# Altium schematic sheet USB.SchDoc
size A
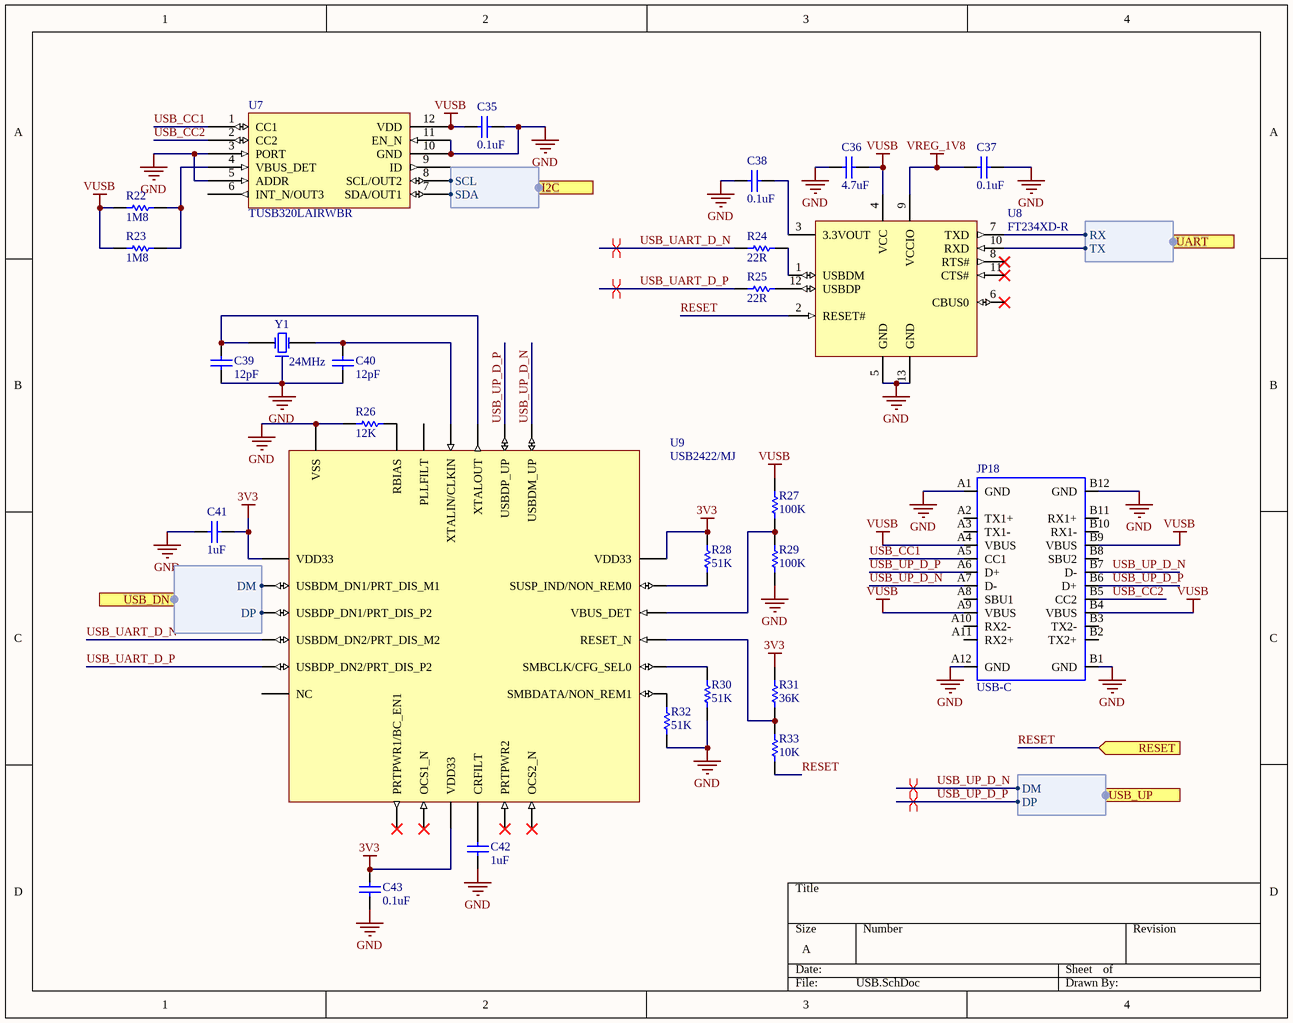
[diagram p0: USB.SchDoc]

## Parts
C35  value 0.1uF  [C0402[1005X55]]  (hidden comment: 0.1uF 6.3V 0402)
C36  value 4.7uF  [C0402[1005X55]]  (hidden comment: 4.7uF 6.3V 0402)
C37  value 0.1uF  [C0402[1005X55]]  (hidden comment: 0.1uF 6.3V 0402)
C38  value 0.1uF  [C0402[1005X55]]  (hidden comment: 0.1uF 6.3V 0402)
C39  value 12pF  [C0402[1005X55]]  (hidden comment: 12pF 50V 0402)
C40  value 12pF  [C0402[1005X55]]  (hidden comment: 12pF 50V 0402)
C41  value 1uF  [C0402[1005X55]]  (hidden comment: 1uF 6.3V 0402)
C42  value 1uF  [C0402[1005X55]]  (hidden comment: 1uF 6.3V 0402)
C43  value 0.1uF  [C0402[1005X55]]  (hidden comment: 0.1uF 6.3V 0402)
JP18  USB-C  [USB-C-3.1]
R22  value 1M8  [R0402[1005]]  (hidden comment: 1M8 1% 0402)
R23  value 1M8  [R0402[1005]]  (hidden comment: 1M8 1% 0402)
R24  value 22R  [R0402[1005]]  (hidden comment: 22R 1% 0402)
R25  value 22R  [R0402[1005]]  (hidden comment: 22R 1% 0402)
R26  value 12K  [R0402[1005]]  (hidden comment: 12K 1% 0402)
R27  value 100K  [R0402[1005]]  (hidden comment: 100K 1% 0402)
R28  value 51K  [R0402[1005]]  (hidden comment: 51K 1% 0402)
R29  value 100K  [R0402[1005]]  (hidden comment: 100K 1% 0402)
R30  value 51K  [R0402[1005]]  (hidden comment: 51K 1% 0402)
R31  value 36K  [R0402[1005]]  (hidden comment: 36K 1% 0402)
R32  value 51K  [R0402[1005]]  (hidden comment: 51K 1% 0402)
R33  value 10K  [R0402[1005]]  (hidden comment: 10K 1% 0402)
U7  TUSB320LAIRWBR  [X2QFN-12]
U8  FT234XD-R  [DFN-12]
U9  USB2422/MJ  [QFN-24 (4x4MM)]
Y1  24MHz  [CRYSTAL_2.0x1.6]

## Ports
I2C (harness I2C), RESET (in), UART (harness UART), USB_DN (harness USB), USB_UP (harness USB)

## Harnesses
USB: DM, DP
UART: TX, RX
I2C: SCL, SDA

## Nets
3V3: C41.2 C43.2 R28.2 R31.2 U9.1(VDD33) U9.9(VDD33) U9.18(VDD33)
GND: C35.1 C36.2 C37.1 C38.2 C39.1 C40.1 C41.1 C42.1 C43.1 JP18.A1(GND) JP18.A12(GND) JP18.B1(GND) JP18.B12(GND) R26.1 R29.1 R30.1 R32.1 U7.3(PORT) U7.5(ADDR) U7.10(GND) U7.11(EN_N) U8.5(GND) U8.13(GND) U9.25(VSS) Y1.2
VREG_1V8: C37.2 U8.9(VCCIO)
VUSB: C35.2 C36.1 JP18.A4(VBUS) JP18.A9(VBUS) JP18.B4(VBUS) JP18.B9(VBUS) R22.1 R23.1 R27.2 U7.12(VDD) U8.4(VCC)
RESET: R33.1 U8.2(RESET#) ; port RESET
USB_CC1: JP18.A5(CC1) U7.1(CC1)
USB_CC2: JP18.B5(CC2) U7.2(CC2)
USB_UART_D_N: R24.1 U9.4(USBDM_DN2/PRT_DIS_M2)
USB_UART_D_P: R25.1 U9.5(USBDP_DN2/PRT_DIS_P2)
USB_UP_D_N: JP18.A7(D-) JP18.B7(D-) U9.19(USBDM_UP) ; port USB_UP.DM
USB_UP_D_P: JP18.A6(D+) JP18.B6(D+) U9.20(USBDP_UP) ; port USB_UP.DP
NetC38_1: C38.1 U8.3(3.3VOUT)
NetC39_2: C39.2 U9.21(XTALOUT) Y1.1(X1)
NetC40_2: C40.2 U9.22(XTALIN/CLKIN) Y1.3(X2)
NetC42_2: C42.2 U9.10(CRFILT)
NetR22_2: R22.2 R23.2 U7.4(VBUS_DET)
NetR24_2: R24.2 U8.1(USBDM)
NetR25_2: R25.2 U8.12(USBDP)
NetR26_2: R26.2 U9.24(RBIAS)
NetR27_1: R27.1 R29.2 U9.16(VBUS_DET)
NetR28_1: R28.1 U9.17(SUSP_IND/NON_REM0)
NetR30_2: R30.2 U9.14(SMBCLK/CFG_SEL0)
NetR31_1: R31.1 R33.2 U9.15(RESET_N)
NetR32_2: R32.2 U9.13(SMBDATA/NON_REM1)
NetU7_7: U7.7(SDA/OUT1) ; port I2C.SDA
NetU7_8: U7.8(SCL/OUT2) ; port I2C.SCL
NetU8_7: U8.7(TXD) ; port UART.RX
NetU8_10: U8.10(RXD) ; port UART.TX
NetU9_2: U9.2(USBDM_DN1/PRT_DIS_M1) ; port USB_DN.DM
NetU9_3: U9.3(USBDP_DN1/PRT_DIS_P2) ; port USB_DN.DP

Not connected (* = marked no-connect by the designer): JP18 A2(TX1+) A3(TX1-) A8(SBU1) A10(RX2-) A11(RX2+) B2(TX2+) B3(TX2-) B8(SBU2) B10(RX1-) B11(RX1+); U7 6(INT_N/OUT3) 9(ID); U8 6(CBUS0)* 8(RTS#)* 11(CTS#)*; U9 6(NC) 7(PRTPWR1/BC_EN1)* 8(OCS1_N)* 11(PRTPWR2)* 12(OCS2_N)* 23(PLLFILT)

## Layout directives
differential pair: USB_UART_D_N, USB_UART_D_P, USB_UP_D_N, USB_UP_D_P

## Library data of the parts
C35 C37 C38 C43 = CAP_0.1uF_6.3V_0402_10%: 0.1uF 6.3V 10% 0402 (1005 Metric); PartNumber: GRM155R70J104KA01D; Manufacturer: Murata; Mounting Technology: Surface Mount; PackageReference: 0402; PackageDescription: 0402 (1005 Metric); Voltage: 6.3V; Tolerance: 10%
C36 = CAP_4.7uF_6.3V_0402_20%: 4.7uF 6.3V 20% 0402 (1005 Metric); PartNumber: GRM155R60J475ME47D; Manufacturer: Murata; Mounting Technology: Surface Mount; PackageReference: 0402; PackageDescription: 0402 (1005 Metric); Voltage: 6.3V; Tolerance: 20%
C39 C40 = CAP_12pF_50V_0402_5%: 12pF 50V 5% 0402 (1005 Metric); PartNumber: GRM1555C1H120JA01D; Manufacturer: Murata; Mounting Technology: Surface Mount; PackageReference: 0402; PackageDescription: 0402 (1005 Metric); Voltage: 50V; Tolerance: 5%
C41 C42 = CAP_1uF_6.3V_0402_10%: 1uF 6.3V 10% 0402 (1005 Metric); PartNumber: GRM155R70J105KA12D; Manufacturer: Murata; Mounting Technology: Surface Mount; PackageReference: 0402; PackageDescription: 0402 (1005 Metric); Voltage: 6.3V; Tolerance: 10%
JP18 = USB_C_3.1_SMT: PartNumber: 12401610E4#2A; Manufacturer: Amphenol FCI; Mounting Technology: Surface Mount; PackageReference: USB 3.1 - Type C
R22 R23 = RES_1M8_0402_1%: 1M8 0.063W 1% 0402 (1005 Metric); Manufacturer: KOA Speer; PartNumber: RK73H1ETTP1804F; Tolerance: 1%; Power: 0.063W; Mounting Technology: Surface Mount; PackageReference: 0402; PackageDescription: 0402 (1005 Metric); ComponentLink1Description: Datasheet; ComponentLink1URL: http://www.koaspeer.com/catimages/Products/RK73H/RK73H.pdf
R24 R25 = RES_22R_0402_1%: 22R 0.063W 1% 0402 (1005 Metric); Manufacturer: KOA Speer; PartNumber: RK73H1ETTP22R0F; Tolerance: 1%; Power: 0.063W; Mounting Technology: Surface Mount; PackageReference: 0402; PackageDescription: 0402 (1005 Metric); ComponentLink1Description: Datasheet; ComponentLink1URL: http://www.koaspeer.com/catimages/Products/RK73H/RK73H.pdf
R26 = RES_12K_0402_1%: 12K 0.063W 1% 0402 (1005 Metric); Manufacturer: KOA Speer; PartNumber: RK73H1ETTP1202F; Tolerance: 1%; Power: 0.063W; Mounting Technology: Surface Mount; PackageReference: 0402; PackageDescription: 0402 (1005 Metric); ComponentLink1Description: Datasheet; ComponentLink1URL: http://www.koaspeer.com/catimages/Products/RK73H/RK73H.pdf
R27 R29 = RES_100K_0402_1%: 100K 0.063W 1% 0402 (1005 Metric); Manufacturer: KOA Speer; PartNumber: RK73H1ETTP1003F; Tolerance: 1%; Power: 0.063W; Mounting Technology: Surface Mount; PackageReference: 0402; PackageDescription: 0402 (1005 Metric); ComponentLink1Description: Datasheet; ComponentLink1URL: http://www.koaspeer.com/catimages/Products/RK73H/RK73H.pdf
R28 R30 R32 = RES_51K_0402_1%: 51K 0.063W 1% 0402 (1005 Metric); Manufacturer: KOA Speer; PartNumber: RK73H1ETTP5102F; Tolerance: 1%; Power: 0.063W; Mounting Technology: Surface Mount; PackageReference: 0402; PackageDescription: 0402 (1005 Metric); ComponentLink1Description: Datasheet; ComponentLink1URL: http://www.koaspeer.com/catimages/Products/RK73H/RK73H.pdf
R31 = RES_36K_0402_1%: 36K 0.063W 1% 0402 (1005 Metric); Manufacturer: KOA Speer; PartNumber: RK73H1ETTP3602F; Tolerance: 1%; Power: 0.063W; Mounting Technology: Surface Mount; PackageReference: 0402; PackageDescription: 0402 (1005 Metric); ComponentLink1Description: Datasheet; ComponentLink1URL: http://www.koaspeer.com/catimages/Products/RK73H/RK73H.pdf
R33 = RES_10K_0402_1%: 10K 0.063W 1% 0402 (1005 Metric); Manufacturer: KOA Speer; PartNumber: RK73H1ETTP1002F; Tolerance: 1%; Power: 0.063W; Mounting Technology: Surface Mount; PackageReference: 0402; PackageDescription: 0402 (1005 Metric); ComponentLink1Description: Datasheet; ComponentLink1URL: http://www.koaspeer.com/catimages/Products/RK73H/RK73H.pdf
U7 = TUSB320LAIRWBR: USB Interface IC Type-C Configuration Channel Logic and Port Control 12-X2QFN -40 to 85; Manufacturer: Texas Instruments; PackageReference: QFN-12; Mounting Technology: Surface Mount; PartNumber: TUSB320LAIRWBR
U8 = FT234XD-R: USB Interface IC USB to Serial UART Interface; Manufacturer: FTDI; PartNumber: FT234XD-R; PackageReference: DFN-12; Mounting Technology: Surface Mount
U9 = USB2422/MJ: USB Hub IC 2-Port; Manufacturer: Microchip; PartNumber: USB2422/MJ; PackageReference: QFN-24; Mounting Technology: Surface Mount
Y1 = FA-128 24.0000MF10Z-W3: Manufacturer: EPSON; PartNumber: FA-128 24.0000MF10Z-W3; Mounting Technology: Surface Mount; PackageReference: 4-SMD